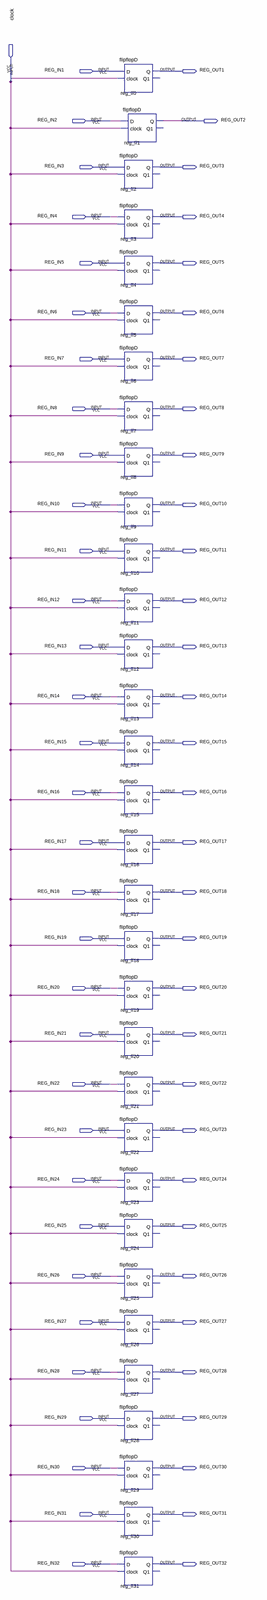
[diagram p0: schematic sheet, whole]
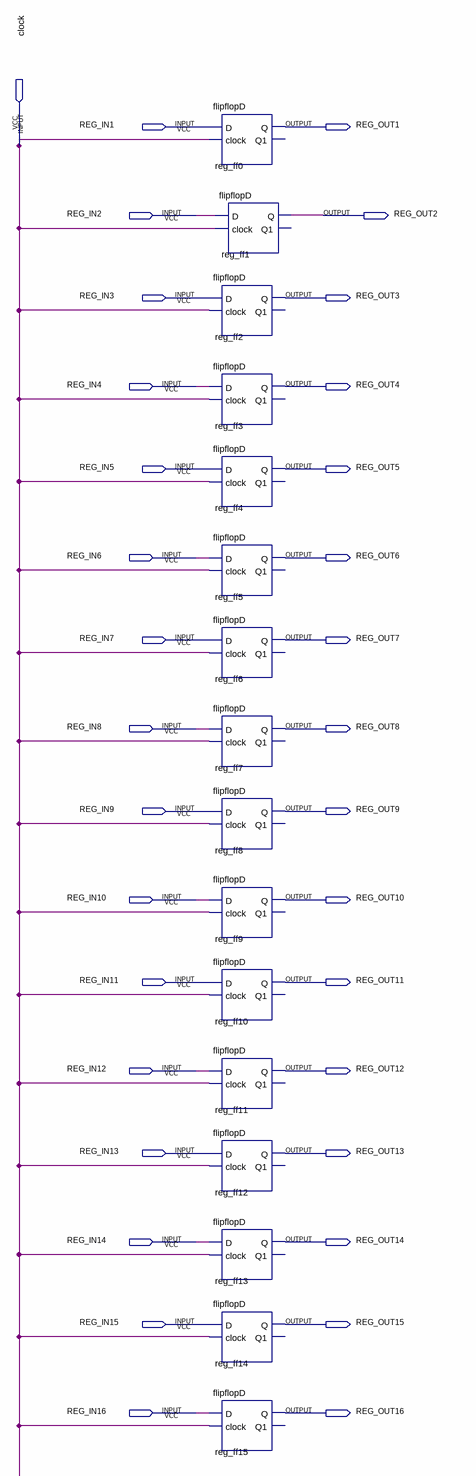
[diagram p1: schematic sheet, upper part]
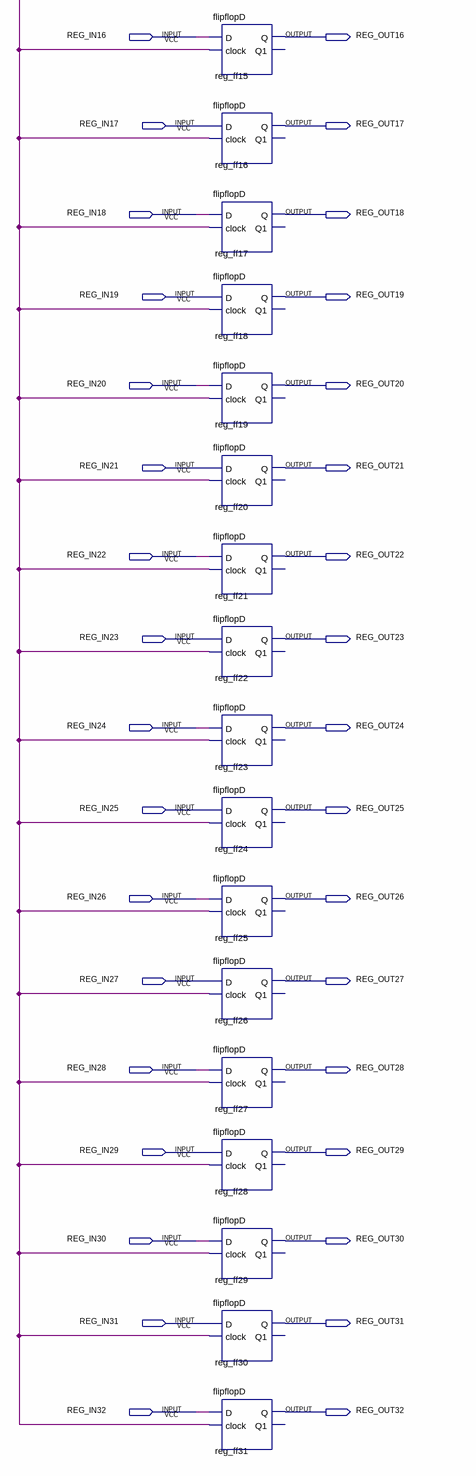
[diagram p2: schematic sheet, lower part]
// Quartus schematic reg32.bdf as structural Verilog: 32 symbols, 65 pins
module reg32 (
  input  REG_IN1,
  input  clock,
  input  REG_IN2,
  input  REG_IN3,
  input  REG_IN4,
  input  REG_IN5,
  input  REG_IN6,
  input  REG_IN7,
  input  REG_IN8,
  input  REG_IN9,
  input  REG_IN10,
  input  REG_IN11,
  input  REG_IN12,
  input  REG_IN13,
  input  REG_IN14,
  input  REG_IN15,
  input  REG_IN16,
  input  REG_IN17,
  input  REG_IN18,
  input  REG_IN19,
  input  REG_IN20,
  input  REG_IN21,
  input  REG_IN22,
  input  REG_IN23,
  input  REG_IN24,
  input  REG_IN25,
  input  REG_IN26,
  input  REG_IN27,
  input  REG_IN28,
  input  REG_IN29,
  input  REG_IN30,
  input  REG_IN31,
  input  REG_IN32,
  output REG_OUT1,
  output REG_OUT2,
  output REG_OUT3,
  output REG_OUT4,
  output REG_OUT5,
  output REG_OUT6,
  output REG_OUT7,
  output REG_OUT8,
  output REG_OUT9,
  output REG_OUT10,
  output REG_OUT11,
  output REG_OUT12,
  output REG_OUT13,
  output REG_OUT14,
  output REG_OUT15,
  output REG_OUT16,
  output REG_OUT17,
  output REG_OUT18,
  output REG_OUT19,
  output REG_OUT20,
  output REG_OUT21,
  output REG_OUT22,
  output REG_OUT23,
  output REG_OUT24,
  output REG_OUT25,
  output REG_OUT26,
  output REG_OUT27,
  output REG_OUT28,
  output REG_OUT29,
  output REG_OUT30,
  output REG_OUT31,
  output REG_OUT32
);

  flipflopD reg_ff0 (.D(REG_IN1), .clock(clock), .Q(REG_OUT1));  // open: Q1
  flipflopD reg_ff1 (.D(REG_IN2), .clock(clock), .Q(REG_OUT2));  // open: Q1
  flipflopD reg_ff2 (.D(REG_IN3), .clock(clock), .Q(REG_OUT3));  // open: Q1
  flipflopD reg_ff3 (.D(REG_IN4), .clock(clock), .Q(REG_OUT4));  // open: Q1
  flipflopD reg_ff4 (.D(REG_IN5), .clock(clock), .Q(REG_OUT5));  // open: Q1
  flipflopD reg_ff5 (.D(REG_IN6), .clock(clock), .Q(REG_OUT6));  // open: Q1
  flipflopD reg_ff6 (.D(REG_IN7), .clock(clock), .Q(REG_OUT7));  // open: Q1
  flipflopD reg_ff7 (.D(REG_IN8), .clock(clock), .Q(REG_OUT8));  // open: Q1
  flipflopD reg_ff8 (.D(REG_IN9), .clock(clock), .Q(REG_OUT9));  // open: Q1
  flipflopD reg_ff9 (.D(REG_IN10), .clock(clock), .Q(REG_OUT10));  // open: Q1
  flipflopD reg_ff10 (.D(REG_IN11), .clock(clock), .Q(REG_OUT11));  // open: Q1
  flipflopD reg_ff11 (.D(REG_IN12), .clock(clock), .Q(REG_OUT12));  // open: Q1
  flipflopD reg_ff12 (.D(REG_IN13), .clock(clock), .Q(REG_OUT13));  // open: Q1
  flipflopD reg_ff13 (.D(REG_IN14), .clock(clock), .Q(REG_OUT14));  // open: Q1
  flipflopD reg_ff14 (.D(REG_IN15), .clock(clock), .Q(REG_OUT15));  // open: Q1
  flipflopD reg_ff15 (.D(REG_IN16), .clock(clock), .Q(REG_OUT16));  // open: Q1
  flipflopD reg_ff16 (.D(REG_IN17), .clock(clock), .Q(REG_OUT17));  // open: Q1
  flipflopD reg_ff17 (.D(REG_IN18), .clock(clock), .Q(REG_OUT18));  // open: Q1
  flipflopD reg_ff18 (.D(REG_IN19), .clock(clock), .Q(REG_OUT19));  // open: Q1
  flipflopD reg_ff19 (.D(REG_IN20), .clock(clock), .Q(REG_OUT20));  // open: Q1
  flipflopD reg_ff20 (.D(REG_IN21), .clock(clock), .Q(REG_OUT21));  // open: Q1
  flipflopD reg_ff21 (.D(REG_IN22), .clock(clock), .Q(REG_OUT22));  // open: Q1
  flipflopD reg_ff22 (.D(REG_IN23), .clock(clock), .Q(REG_OUT23));  // open: Q1
  flipflopD reg_ff23 (.D(REG_IN24), .clock(clock), .Q(REG_OUT24));  // open: Q1
  flipflopD reg_ff24 (.D(REG_IN25), .clock(clock), .Q(REG_OUT25));  // open: Q1
  flipflopD reg_ff25 (.D(REG_IN26), .clock(clock), .Q(REG_OUT26));  // open: Q1
  flipflopD reg_ff26 (.D(REG_IN27), .clock(clock), .Q(REG_OUT27));  // open: Q1
  flipflopD reg_ff27 (.D(REG_IN28), .clock(clock), .Q(REG_OUT28));  // open: Q1
  flipflopD reg_ff28 (.D(REG_IN29), .clock(clock), .Q(REG_OUT29));  // open: Q1
  flipflopD reg_ff29 (.D(REG_IN30), .clock(clock), .Q(REG_OUT30));  // open: Q1
  flipflopD reg_ff30 (.D(REG_IN31), .clock(clock), .Q(REG_OUT31));  // open: Q1
  flipflopD reg_ff31 (.D(REG_IN32), .clock(clock), .Q(REG_OUT32));  // open: Q1
endmodule
